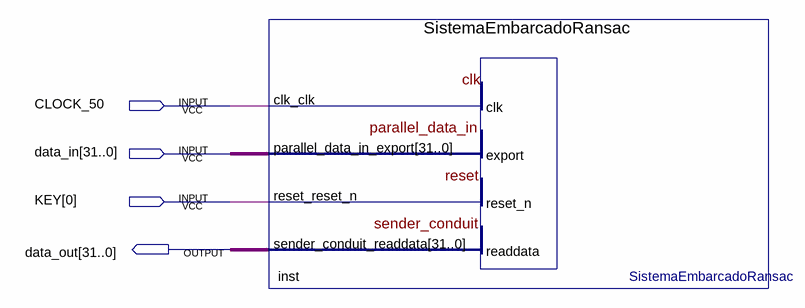
[diagram p0: schematic sheet]
// Quartus schematic RANSAC_NIOS.bdf as structural Verilog: 1 symbols, 4 pins
module RANSAC_NIOS (
  input  CLOCK_50,
  input  [31:0] data_in,
  input  [0:0] KEY,
  output [31:0] data_out
);

  SistemaEmbarcadoRansac inst (
    .clk_clk(CLOCK_50), .parallel_data_in_export(data_in), .reset_reset_n(KEY[0]),
    .sender_conduit_readdata(data_out));
endmodule
